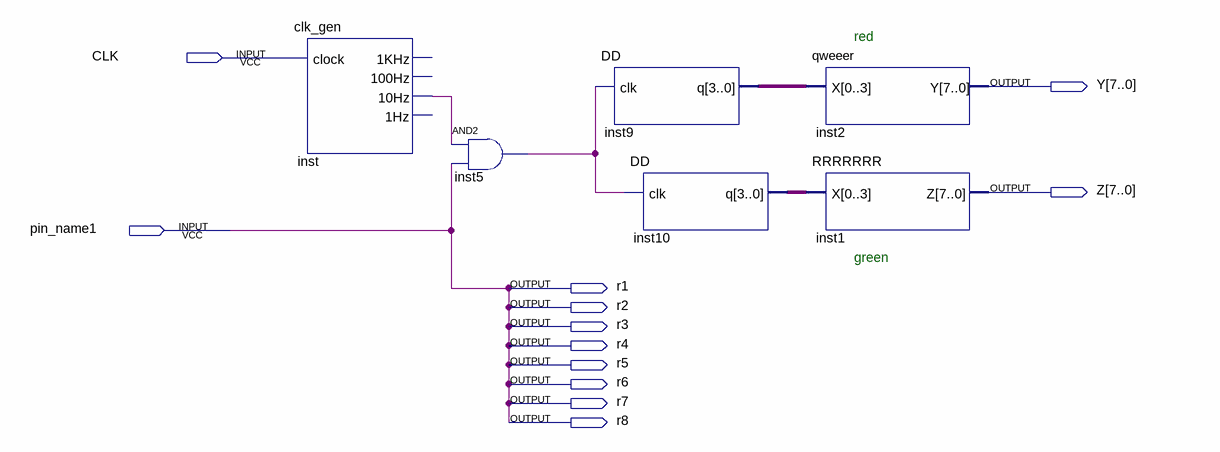
[diagram p0: schematic sheet]
// Quartus schematic 88LED.bdf as structural Verilog: 6 symbols, 12 pins
module \88LED  (
  input  CLK,
  input  pin_name1,
  output [7:0] Y,
  output [7:0] Z,
  output r1,
  output r2,
  output r3,
  output r4,
  output r5,
  output r6,
  output r7,
  output r8
);

  wire inst5_out, inst_10hz;
  wire [3:0] inst9_q, inst10_q;

  clk_gen inst (.clock(CLK), .\10Hz (inst_10hz));  // open: 1KHz, 100Hz, 1Hz
  and inst5 (inst5_out, inst_10hz, pin_name1);
  DD inst9 (.clk(inst5_out), .q(inst9_q));
  DD inst10 (.clk(inst5_out), .q(inst10_q));
  qweeer inst2 (.X(inst9_q), .Y(Y));
  RRRRRRR inst1 (.X(inst10_q), .Z(Z));

  assign r1 = pin_name1;
  assign r2 = pin_name1;
  assign r3 = pin_name1;
  assign r4 = pin_name1;
  assign r5 = pin_name1;
  assign r6 = pin_name1;
  assign r7 = pin_name1;
  assign r8 = pin_name1;

  // Notes on the sheet:
  //   red
  //   green
endmodule
